# EAGLE design IRIS (EAGLE 6.2)
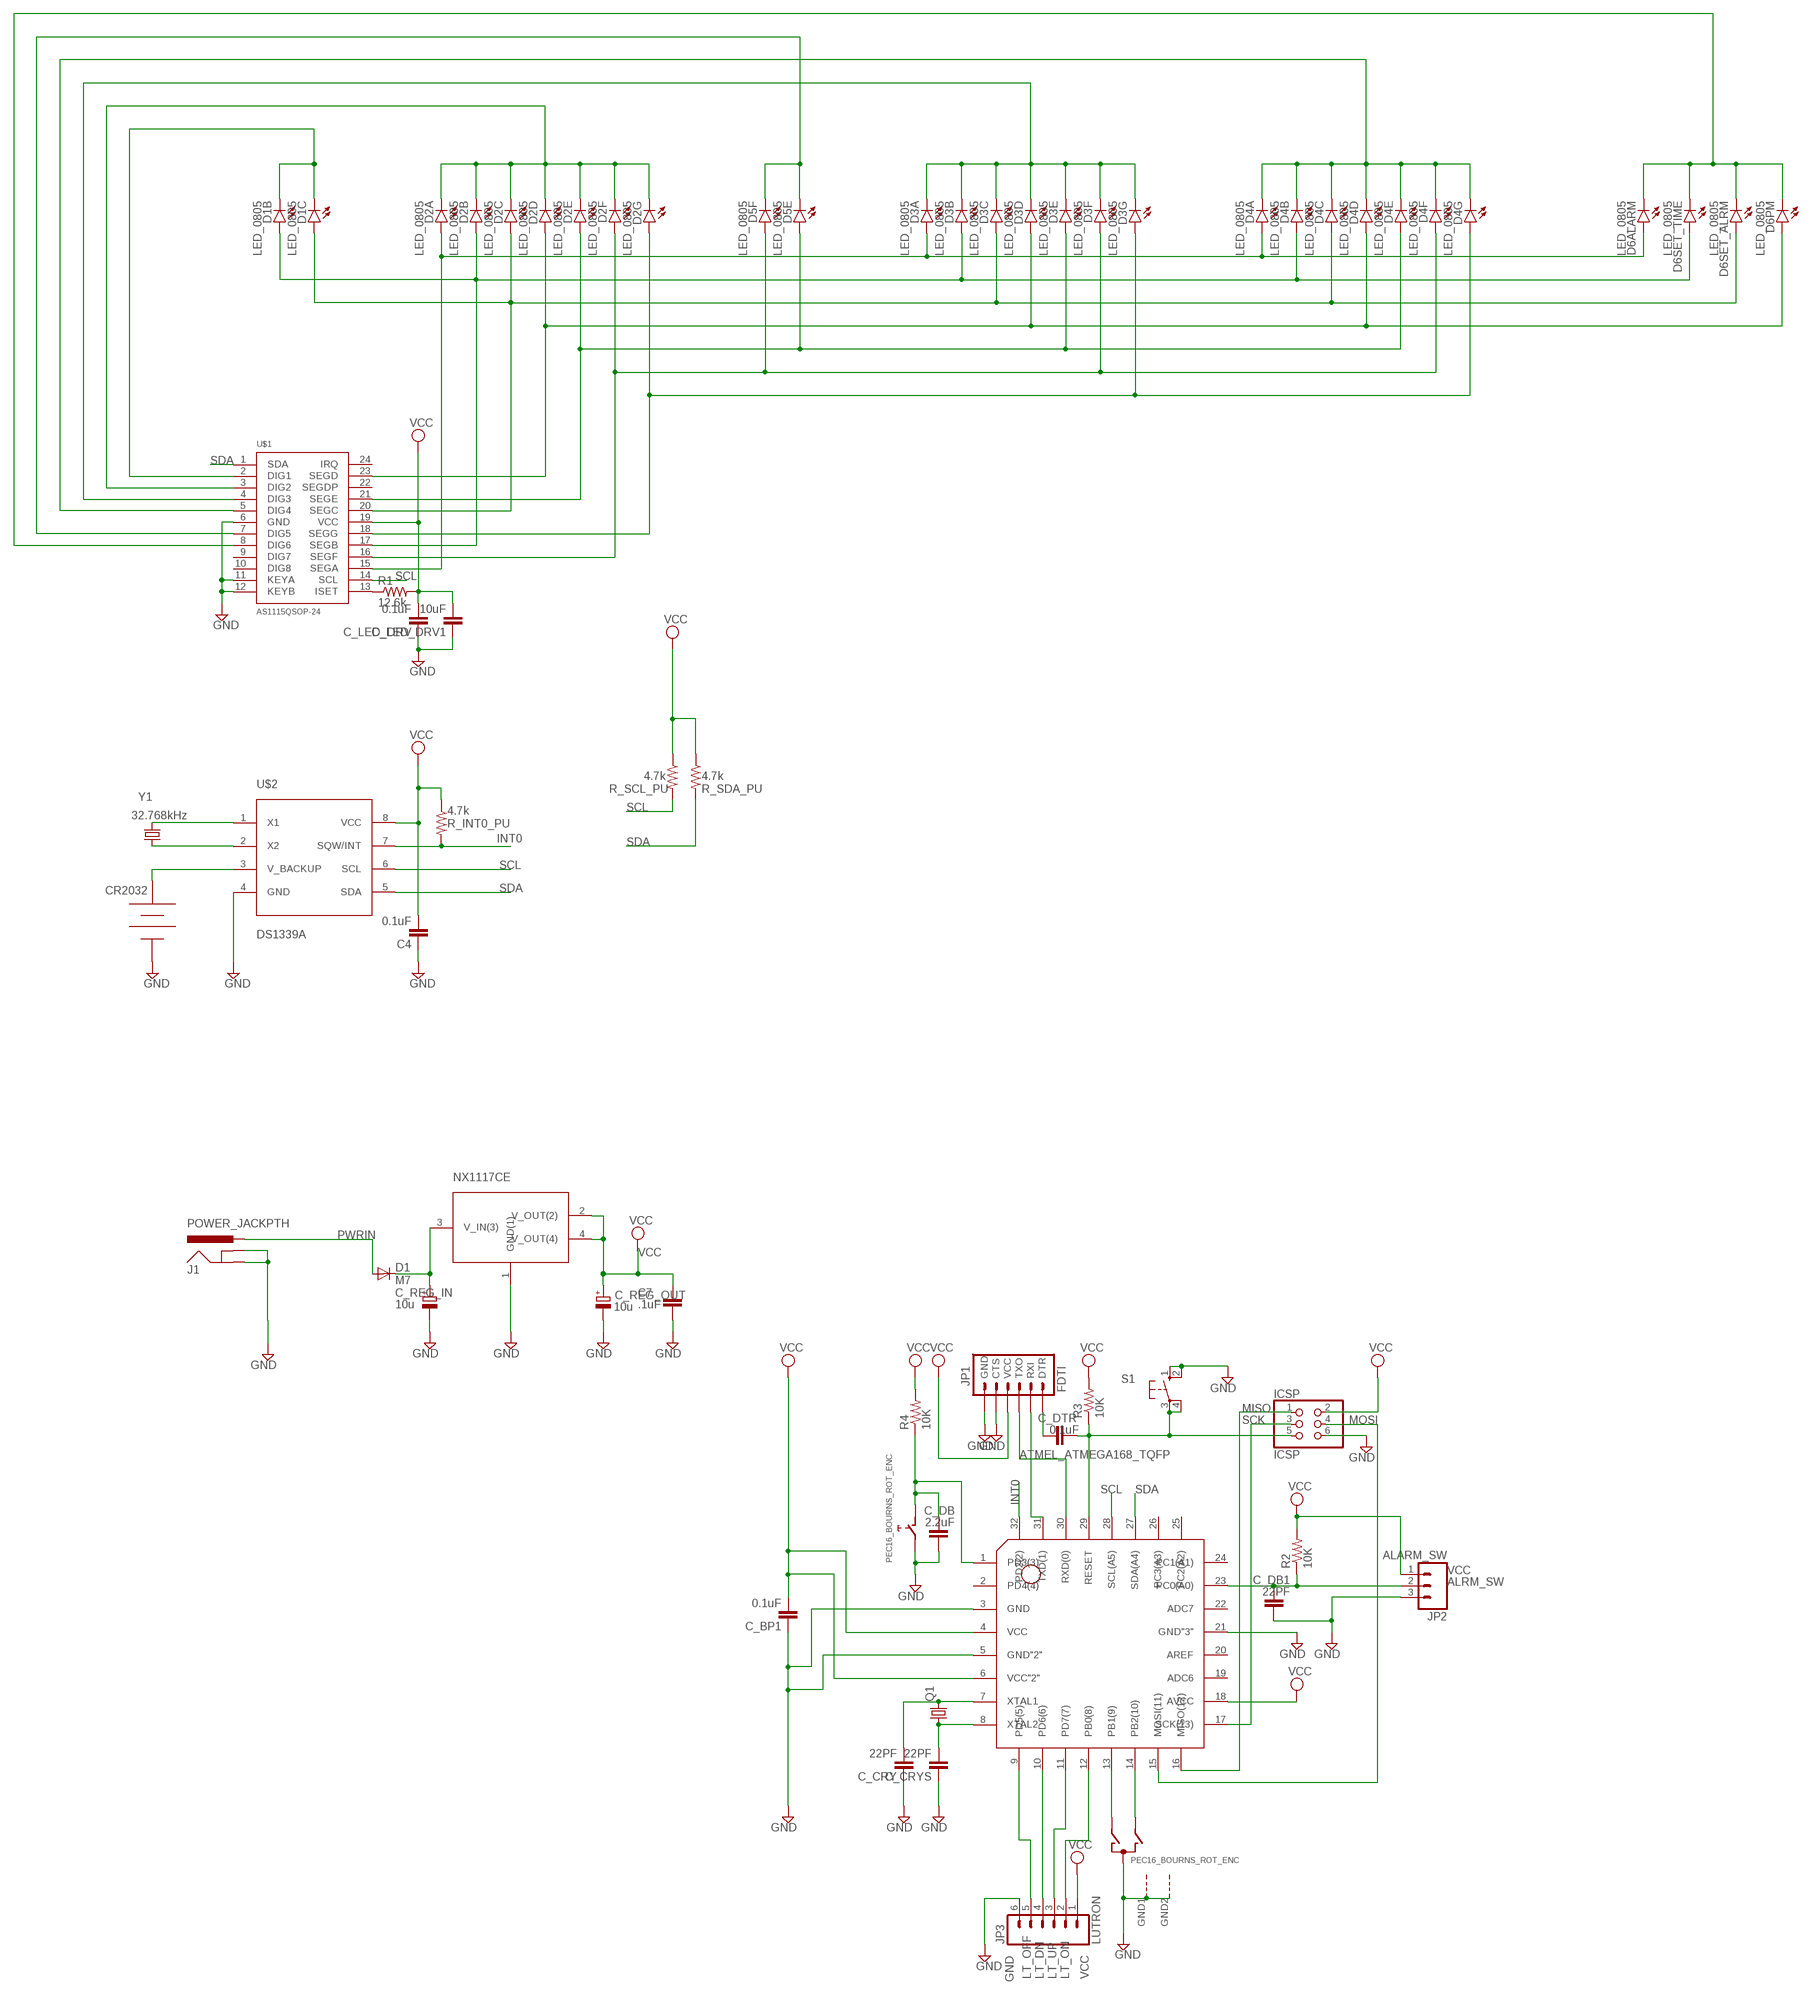
[diagram p0: schematic, sheet 1]

## Parts
C4  0.1uF  CAP0805  [0805]
C7  .1uF  C-EU0603-RND  [C0603-ROUND]
C_BP1  0.1uF  CAP0805  [0805]
C_CRY  22PF  CAP0805  [0805]
C_CRYS  22PF  CAP0805  [0805]
C_DB  2.2uF  CAP0805  [0805]
C_DB1  22PF  CAP0805  [0805]
C_DTR  0.1uF  CAP0805  [0805]
C_LED_DRV  0.1uF  CAP0805  [0805]
C_LED_DRV1  10uF  CAP0805  [0805]
C_REG_IN  10u  CPOL-EUD  [PANASONIC_D]
C_REG_OUT  10u  CPOL-EUD  [PANASONIC_D]
D1  M7  DIODE-SMB  [SMB]
D1B  LED_0805  [LED_0805]
D1C  LED_0805  [LED_0805]
D2A  LED_0805  [LED_0805]
D2B  LED_0805  [LED_0805]
D2C  LED_0805  [LED_0805]
D2D  LED_0805  [LED_0805]
D2E  LED_0805  [LED_0805]
D2F  LED_0805  [LED_0805]
D2G  LED_0805  [LED_0805]
D3A  LED_0805  [LED_0805]
D3B  LED_0805  [LED_0805]
D3C  LED_0805  [LED_0805]
D3D  LED_0805  [LED_0805]
D3E  LED_0805  [LED_0805]
D3F  LED_0805  [LED_0805]
D3G  LED_0805  [LED_0805]
D4A  LED_0805  [LED_0805]
D4B  LED_0805  [LED_0805]
D4C  LED_0805  [LED_0805]
D4D  LED_0805  [LED_0805]
D4E  LED_0805  [LED_0805]
D4F  LED_0805  [LED_0805]
D4G  LED_0805  [LED_0805]
D5E  LED_0805  [LED_0805]
D5F  LED_0805  [LED_0805]
D6ALARM  LED_0805  [LED_0805]
D6PM  LED_0805  [LED_0805]
D6SET_ALRM  LED_0805  [LED_0805]
D6SET_TIME  LED_0805  [LED_0805]
ICSP  ICSP  PINHD-2X3  [2X03]
J1  POWER_JACKPTH  [POWER_JACK_PTH]
JP1  FDTI  ARDUINO_SERIAL_PROGRAMLONGPADS  [1X06_LONGPADS]
JP2  ALARM_SW  M03LONGPADS  [1X03_LONGPADS]
JP3  LUTRON  M06LONGPADS  [1X06_LONGPADS]
Q1  CRYSTALHC49S  [HC49/S]
R1  12.6k  R-US_R0805  [R0805]
R2  10K  R-US_R0805  [R0805]
R3  10K  R-US_R0805  [R0805]
R4  10K  R-US_R0805  [R0805]
R_INT0_PU  4.7k  R-US_R0805  [R0805]
R_SCL_PU  4.7k  R-US_R0805  [R0805]
R_SDA_PU  4.7k  R-US_R0805  [R0805]
S1  10-XX  [B3F-10XX]
U$1  AS1115QSOP-24  [SSOP24]
U$2  DS1339A  [8_USOP]
U$3  CR2032  [CR2032]
U$4  PEC16_BOURNS_ROT_ENC  [ENCODER_ROTARY]
U$5  ATMEL_ATMEGA168_TQFP  [TQFP_32_ATMEGA168]
U$6  NX1117CE  [LINEAR_REG_SOT223]
Y1  32.768kHz  CRYSTAL32-SMD  [CRYSTAL-32KHZ-SMD]

## Nets
ALRM_SW: C_DB1.2 JP2.2 R2.1 U$5.23(PC0(A0))
D6TIME: D6ALARM.C D6PM.C D6SET_ALRM.C D6SET_TIME.C U$1.8(DIG6)
DIGIT1: D1B.C D1C.C U$1.2(DIG1)
DIGIT2: D2A.C D2B.C D2C.C D2D.C D2E.C D2F.C D2G.C U$1.3(DIG2)
DIGIT3: D3A.C D3B.C D3C.C D3D.C D3E.C D3F.C D3G.C U$1.4(DIG3)
DIGIT4: D4A.C D4B.C D4C.C D4D.C D4E.C D4F.C D4G.C U$1.5(DIG4)
DIGIT5: D5E.C D5F.C U$1.7(DIG5)
GND: C4.1 C7.1 C_BP1.1 C_CRY.1 C_CRYS.1 C_DB1.1 C_DB.1 C_LED_DRV1.1 C_LED_DRV.1 C_REG_IN.- C_REG_OUT.- ICSP.6 J1.GND J1.GNDBREAK JP1.5(CTS) JP1.6(GND) JP2.3 JP3.6 S1.1(S) S1.2(S1) U$1.6(GND) U$1.11(KEYA) U$1.12(KEYB) U$2.4(GND) U$3.GND U$4.C U$4.E U$4.GND1(G) U$4.GND2(G) U$5.3(GND) U$5.5(GND"2") U$5.21(GND"3") U$6.1(GND(1))
INT0: R_INT0_PU.2 U$2.7(SQW/INT) U$5.32(PD2(2))
LT_DN: JP3.4 U$5.10(PD6(6))
LT_OFF: JP3.5 U$5.9(PD5(5))
LT_ON: JP3.2 U$5.12(PB0(8))
LT_UP: JP3.3 U$5.11(PD7(7))
MISO: ICSP.1 U$5.16(MISO(12))
MOSI: ICSP.4 U$5.15(MOSI(11))
N$1: D1B.A D2B.A D3B.A D4B.A D6SET_TIME.A U$1.17(SEGB)
N$2: D1C.A D2C.A D3C.A D4C.A D6SET_ALRM.A U$1.20(SEGC)
N$4: U$2.2(X2) Y1.X1
N$5: U$2.1(X1) Y1.X2
N$6: D2A.A D3A.A D4A.A D6ALARM.A U$1.15(SEGA)
N$7: C_DB.2 R4.1 U$4.D U$5.1(PD3(3))
N$9: D2D.A D3D.A D4D.A D6PM.A U$1.23(SEGD)
N$10: D2E.A D3E.A D4E.A D5E.A U$1.21(SEGE)
N$11: D2F.A D3F.A D4F.A D5F.A U$1.16(SEGF)
N$12: D2G.A D3G.A D4G.A U$1.18(SEGG)
N$13: JP1.2(RXI) U$5.31(TXD(1))
N$14: R1.1 U$1.13(ISET)
N$15: JP1.3(TXO) U$5.30(RXD(0))
N$16: C_DTR.2 JP1.1(DTR)
N$18: U$4.A U$5.13(PB1(9))
N$19: U$4.B U$5.14(PB2(10))
N$34: C_CRY.2 Q1.2 U$5.7(XTAL1)
N$35: C_CRYS.2 Q1.1 U$5.8(XTAL2)
PWRIN [power]: D1.A J1.PWR
RESET: C_DTR.1 ICSP.5 R3.1 S1.3(P) S1.4(P1) U$5.29(RESET)
SCK: ICSP.3 U$5.17(SCK(13))
SCL: R_SCL_PU.2 U$1.14(SCL) U$2.6(SCL) U$5.28(SCL(A5))
SDA: R_SDA_PU.2 U$1.1(SDA) U$2.5(SDA) U$5.27(SDA(A4))
V+: U$2.3(V_BACKUP) U$3.V+
V_IN(3): C_REG_IN.+ D1.C U$6.3(V_IN(3))
VCC: C4.2 C7.2 C_BP1.2 C_LED_DRV1.2 C_LED_DRV.2 C_REG_OUT.+ ICSP.2 JP1.4(VCC) JP2.1 JP3.1 R1.2 R2.2 R3.2 R4.2 R_INT0_PU.1 R_SCL_PU.1 R_SDA_PU.1 U$1.19(VCC) U$2.8(VCC) U$5.4(VCC) U$5.6(VCC"2") U$5.18(AVCC) U$6.2(V_OUT(2)) U$6.4(V_OUT(4))
Unconnected: U$1.9(DIG7) U$1.10(DIG8) U$1.22(SEGDP) U$1.24(IRQ) U$5.2(PD4(4)) U$5.19(ADC6) U$5.20(AREF) U$5.22(ADC7) U$5.24(PC1(A1)) U$5.25(PC2(A2)) U$5.26(PC3(A3))

## Library data of the parts
C4 C_BP1 C_CRY C_CRYS C_DB C_DB1 C_DTR C_LED_DRV C_LED_DRV1 = SparkFun:CAP: Capacitor Standard 0603 ceramic capacitor, and 0.1" leaded capacitor.
C7 = SmartPrj:C-EU: CAPACITOR, European symbol
C_REG_IN C_REG_OUT = rcl:CPOL-EU: POLARIZED CAPACITOR, European symbol
D1 = diode:DIODE-: DIODE
D1B D1C D2A D2B D2C D2D D2E D2F D2G D3A D3B D3C D3D D3E D3F D3G D4A D4B D4C D4D D4E D4F D4G D5E D5F D6ALARM D6PM D6SET_ALRM D6SET_TIME = Eady:LED_0805
ICSP = pinhead:PINHD-2X3: PIN HEADER
J1 = SparkFun-Connectors:POWER_JACK: Power Jack This is the standard 5.5mm barrel jack for power. The PTH is the most common, proven, reliable, footprint. All others are experimental. The Slot footprint only works if the mill layer is transmitted to the PCB fab house so be warned. Spark Fun Electronics SKU : PRT-00119. Mating wall wart : TOL-00298 (and others)
JP1 = SparkFun-Connectors:ARDUINO_SERIAL_PROGRAM: FTDI connector footprints
JP2 = SparkFun-Connectors:M03: Header 3 Standard 3-pin 0.1" header. Use with straight break away headers (SKU : PRT-00116), right angle break away headers (PRT-00553), swiss pins (PRT-00743), machine pins (PRT-00117), and female headers (PRT-00115). Molex polarized connector foot print use with SKU : PRT-08232 with associated crimp pins and housings.
JP3 = SparkFun-Connectors:M06: Header 6 Standard 6-pin 0.1" header. Use with straight break away headers (SKU : PRT-00116), right angle break away headers (PRT-00553), swiss pins (PRT-00743), machine pins (PRT-00117), and female headers (PRT-00115). Molex polarized connector foot print use with SKU : PRT-08094 with associated crimp pins and housings. NOTES ON THE VARIANTS LOCK and LOCK_LONGPADS... This footprint was designed to help hold the alignment of a through-hole component (i.e. 6-pin header) while soldering it into place. You may notice that each hole has been shifted either up or down by 0.005 of an inch from it's more standard position (which is a perfectly straight line). This slight alteration caused the pins (the squares in the middle) to touch the edges of the holes. Because they are alternating, it causes a "brace" to hold the component in place. 0.005 has proven to be the perfect amount of "off-center" position when using our standard breakaway headers. Although looks a little odd when you look at the bare footprint, once you have a header in there, the alteration is very hard to notice. Also, if you push a header all the way into place, it is covered up entirely on the bottom side. This idea of altering the position of holes to aid alignment will be further integrated into the Sparkfun Library for other footprints. It can help hold any component with 3 or more connection pins.
Q1 = crystal:CRYSTAL: CRYSTAL; OC_FARNELL: 1667008; OC_NEWARK: unknown
R1-R4 R_INT0_PU R_SCL_PU R_SDA_PU = resistor:R-US_: RESISTOR, American symbol
S1 = switch-omron:10-XX: OMRON SWITCH; MPN: B3F-1000; OC_FARNELL: 176432; OC_NEWARK: 36M3542
U$1 = Eady2:AS1115
U$2 = Eady:DS1339A
U$3 = Eady:CR2032
U$4 = Eady:PEC16_BOURNS_ROT_ENC
U$5 = Eady:ATMEL_ATMEGA168_TQFP
U$6 = Eady:NX1117CE
Y1 = SparkFun-FreqCtrl:CRYSTAL: Various standard crystals. Proven footprints. Spark Fun Electronics SKU : COM-00534

## Net classes
0 default: width 0.254 mm, clearance 0.254 mm
1 power: width 0.61 mm, drill 0.711 mm, clearance 0.33 mm
2 gnd: width 0.305 mm, drill 0.711 mm, clearance 0.254 mm
3 usbvcc: width 0.508 mm, drill 0.711 mm, clearance 0.254 mm
4 aref: width 0.406 mm

## Board
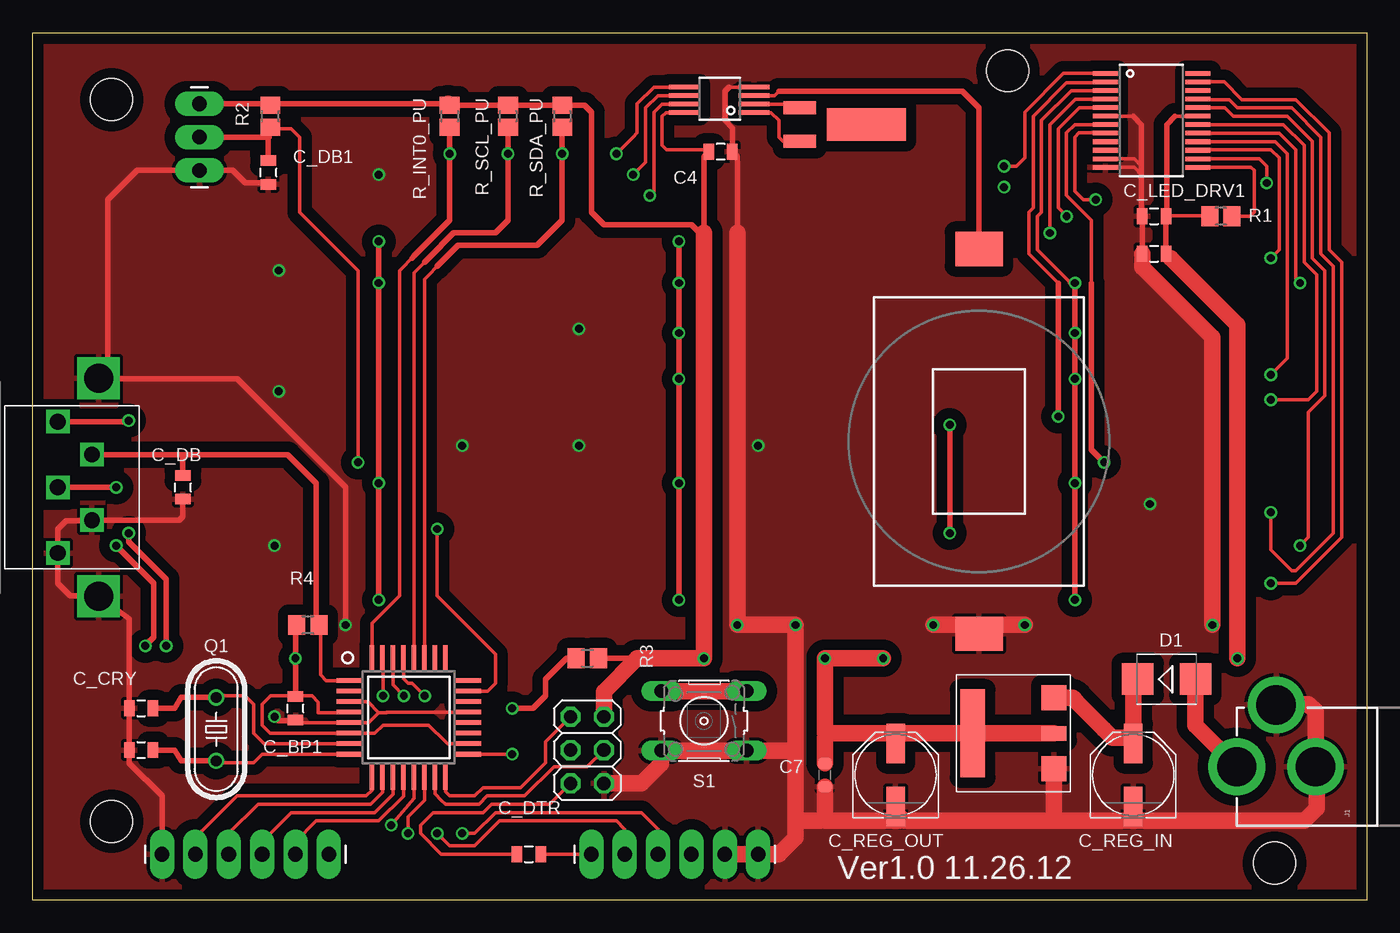
[diagram p1: board, top side]
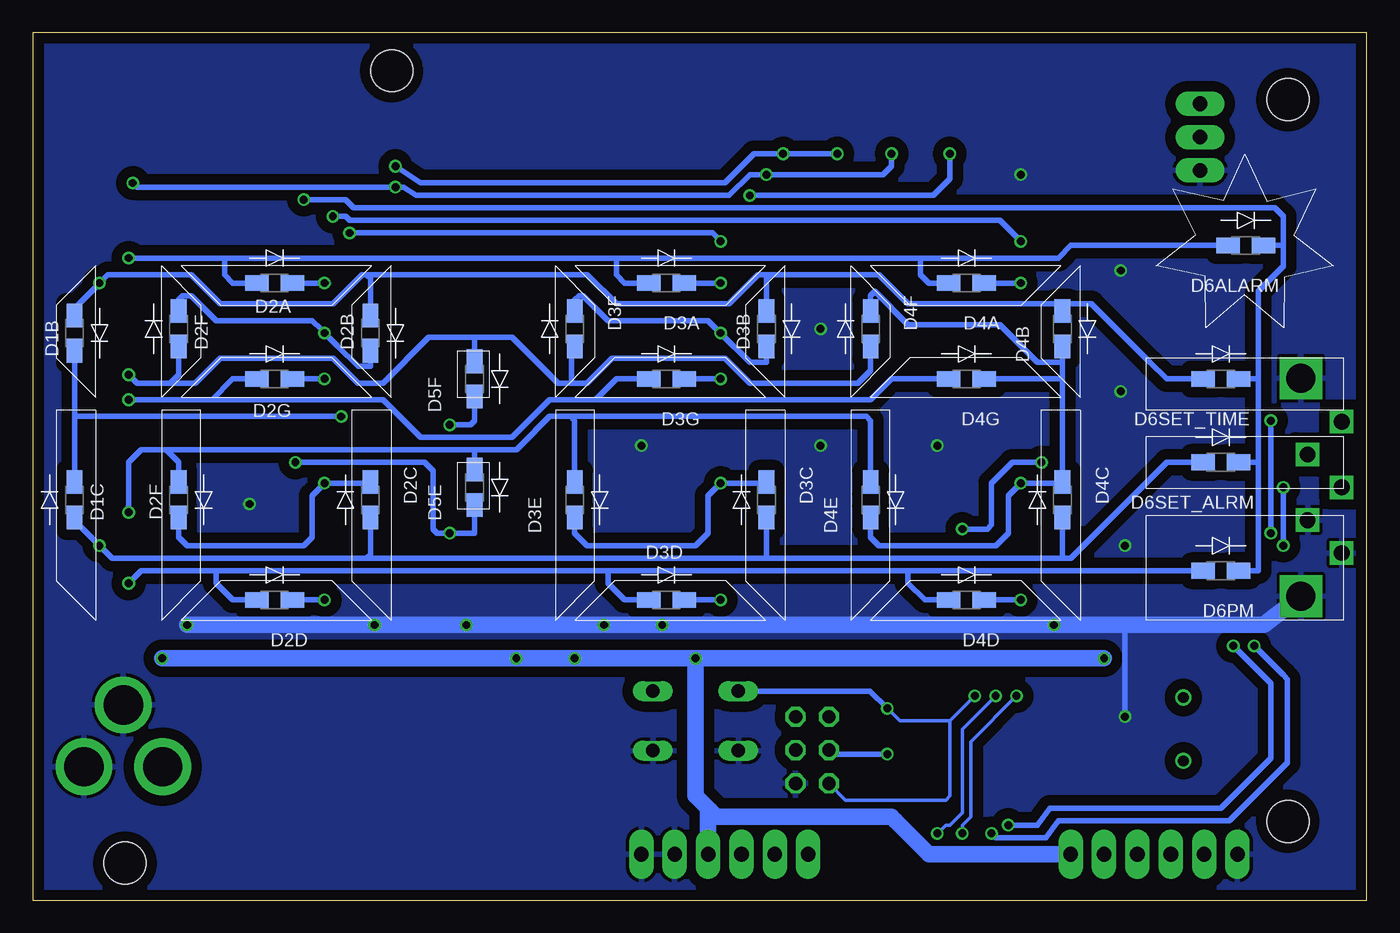
[diagram p2: board, bottom side, seen from below]

Size 101.6 x 66.04 mm. Coordinates in mm from the lower left corner, seen from the top.
Outline: 0,0 0,66.04 101.6,66.04 101.6,0 0,0
Copper layers (1*16): Top 0.0356mm / dielectric 1.5011mm / Bottom 0.0356mm
Design rules: minimum track width 6mil, minimum drill 13mil, track to track 6mil, track to pad 6mil, pad to pad 6mil, via to via 6mil, smd to smd 6mil, copper to edge 15mil, drill to drill 6mil, minimum pad ring 7mil, minimum via ring 7mil, stop-mask expansion 4mil, vias tented up to drill 0mil, thermal gap 10mil
Holes 3.2 mm at 6,6 6,60.95 74.26,63.15 94.58,2.83

### Footprints (pad centres in the part's own frame; a part is rotated, then mirrored left to right if it is on the bottom)
0805 = smd 0.8 x 1.2: 1 -0.9,0; 2 0.9,0
C0603-ROUND = smd 0.898 x 1.1: 1 -0.889,0; 2 0.889,0
PANASONIC_D = smd 3 x 1.4: + 2.4,0; - -2.4,0
SMB = smd 2.4 x 2.4: A 2.2,0; C -2.2,0
LED_0805 = smd 1.8 x 1.2: A -1.35,0; C 1.35,0
2X03 = drill 1.016 octagon: 1 -2.54,-1.27; 2 -2.54,1.27; 3 0,-1.27; 4 0,1.27; 5 2.54,-1.27; 6 2.54,1.27
POWER_JACK_PTH = drill 2.997 pad 4.318: GND 0,7.7; GNDBREAK 4.7,10.7; PWR 0,13.7
1X06_LONGPADS = drill 1.118 pad 1.88 long: 1 0,0; 2 2.54,0; 3 5.08,0; 4 7.62,0; 5 10.16,0; 6 12.7,0
1X03_LONGPADS = drill 1.118 pad 1.88 long: 1 0,0; 2 2.54,0; 3 5.08,0
HC49/S = drill 0.813: 1 -2.413,0; 2 2.413,0
R0805 = smd 1.3 x 1.5: 1 -0.85,0; 2 0.85,0
B3F-10XX = drill 1.016 long: 1 -3.251,2.261; 2 3.251,2.261; 3 -3.251,-2.261; 4 3.251,-2.261
SSOP24 = smd 0.348 x 1.905: 1 -3.575,-3.402; 2 -2.925,-3.402; 3 -2.275,-3.402; 4 -1.625,-3.402; 5 -0.975,-3.402; 6 -0.325,-3.402; 7 0.325,-3.402; 8 0.975,-3.402; 9 1.625,-3.402; 10 2.275,-3.402; 11 2.925,-3.402; 12 3.575,-3.402; 13 3.575,3.656; 14 2.925,3.656; 15 2.275,3.656; 16 1.625,3.656; 17 0.975,3.656; 18 0.325,3.656; 19 -0.325,3.656; 20 -0.975,3.656; 21 -1.625,3.656; 22 -2.275,3.656; 23 -2.925,3.656; 24 -3.575,3.656
8_USOP = smd 2.35 x 0.35: 1 0,1.95; 2 0,1.3; 3 0,0.65; 4 0,0; 5 5.3,0; 6 5.3,0.65; 7 5.3,1.3; 8 5.3,1.95
CR2032 = smd 2.6 x 3.6: GND 14.65,0; V+ -14.65,0
ENCODER_ROTARY = drill 1.2 square: A -5,0; B 0,0; C 5,0; D -2.5,2.6; E 2.5,2.6 | drill 2.2 square: GND1 -8.3,3.1; GND2 8.3,3.1
TQFP_32_ATMEGA168 = smd 2 x 0.35: 1 0,5.6; 2 0,4.8; 3 0,4; 4 0,3.2; 5 0,2.4; 6 0,1.6; 7 0,0.8; 8 0,0; 17 9,0; 18 9,0.8; 19 9,1.6; 20 9,2.4; 21 9,3.2; 22 9,4; 23 9,4.8; 24 9,5.6 | smd 0.35 x 2: 9 1.7,-1.7; 10 2.5,-1.7; 11 3.3,-1.7; 12 4.1,-1.7; 13 4.9,-1.7; 14 5.7,-1.7; 15 6.5,-1.7; 16 7.3,-1.7; 25 7.3,7.3; 26 6.5,7.3; 27 5.7,7.3; 28 4.9,7.3; 29 4.1,7.3; 30 3.3,7.3; 31 2.5,7.3; 32 1.7,7.3
LINEAR_REG_SOT223 = smd 1.9 x 1.9: 1 -2.7,0; 3 2.7,0 | smd 1.1 x 1.9: 2 0,0 | smd 6.7 x 1.9: 4 0,6.2
CRYSTAL-32KHZ-SMD = smd 2.5 x 6: SHEILD 0,5.08 | smd 1 x 2.5: X1 -1.27,0; X2 1.27,0

### Placement (x,y rotation side)
C4  52.39,56.99 180 top
C7  60.33,9.53 90 top
C_BP1  20,14.61 90 top
C_CRY  8.26,14.61 0 top
C_CRYS  8.26,11.43 0 top
C_DB  11.43,31.43 90 top
C_DB1  17.94,55.4 90 top
C_DTR  37.78,3.49 0 top
C_LED_DRV  85.41,52.07 0 top
C_LED_DRV1  85.41,49.21 0 top
C_REG_IN  83.82,9.53 90 top
C_REG_OUT  65.72,9.53 90 top
D1  86.36,16.83 0 top
D1B  98.42,43.18 270 bottom
D1C  98.42,30.48 90 bottom
D2A  83.19,46.99 0 bottom
D2B  75.88,43.18 270 bottom
D2C  75.88,30.48 90 bottom
D2D  83.19,22.86 0 bottom
D2E  90.49,30.48 270 bottom
D2F  90.49,43.5 90 bottom
D2G  83.19,39.69 0 bottom
D3A  53.34,46.99 0 bottom
D3B  45.72,43.5 270 bottom
D3C  45.72,30.48 90 bottom
D3D  53.34,22.86 0 bottom
D3E  60.33,30.48 270 bottom
D3F  60.33,43.5 90 bottom
D3G  53.34,39.69 0 bottom
D4A  30.48,46.99 0 bottom
D4B  23.18,43.5 270 bottom
D4C  23.18,30.48 90 bottom
D4D  30.48,22.86 0 bottom
D4E  37.78,30.48 270 bottom
D4F  37.78,43.5 90 bottom
D4G  30.48,39.69 0 bottom
D5E  67.94,31.43 270 bottom
D5F  67.94,39.69 270 bottom
D6ALARM  9.21,49.85 0 bottom
D6PM  11.11,25.08 0 bottom
D6SET_ALRM  11.11,33.34 0 bottom
D6SET_TIME  11.11,39.69 0 bottom
ICSP  42.23,11.43 270 top
J1  105.41,10.16 90 top
JP1  42.55,3.49 0 top
JP2  12.7,60.64 270 top
JP3  22.54,3.49 180 top
Q1  13.97,13.02 90 top
R1  90.49,52.07 180 top
R2  18.1,59.69 90 top
R3  42.23,18.41 0 top
R4  20.95,20.95 180 top
R_INT0_PU  31.75,59.69 270 top
R_SCL_PU  36.2,59.69 270 top
R_SDA_PU  40.32,59.69 270 top
S1  51.12,13.65 180 top
U$1  85.09,59.37 270 top
U$2  54.93,61.91 180 top
U$3  72.07,34.92 270 top
U$4  1.91,31.43 270 top
U$5  24.13,11.11 0 top
U$6  77.79,12.7 90 top
Y1  58.42,59.05 270 top

### Tracks (layer width: path | path; a pad name or v marks a point on that pad's centre or on a via)
ALRM_SW  (via drill 0.6)
  Top 0.254: U$5.23 34.65,15.91 35.24,16.51 35.24,18.73 30.8,23.18 v30.8,28.26 | v24.77,33.34 24.77,47.94 20.32,52.39 20.32,58.1 19.68,58.74 18.2,58.74 R2.1
  Top 0.406: JP2.2 18,58.1 R2.1 17.94,58.68 C_DB1.2
  Bottom 0.406: v30.8,28.26 28.89,28.26 28.57,28.57 28.57,31.75 26.99,33.34 v24.77,33.34
D6TIME  (via drill 0.6)
  Top 0.254: v80.96,53.34 80.01,53.34 79.38,53.98 79.38,58.1 79.69,58.42 81.67,58.42 U$1.8
  Bottom 0.406: D6PM.C 8.26,25.08 8.26,33.34 | 8.26,33.34 8.26,39.69 | 8.26,39.69 8.26,46.35 6.35,48.26 6.35,49.85 | 6.35,49.85 D6ALARM.C 6.35,49.85 | D6SET_TIME.C 8.26,39.69 | D6SET_ALRM.C 8.26,33.34 | 6.35,49.85 6.35,52.07 6.51,52.23 6.99,52.7 77.15,52.7 77.79,53.34 v80.96,53.34
DIGIT1  (via drill 0.6)
  Top 0.254: U$1.2 81.62,62.23 78.74,62.23 76.2,59.69 76.2,54.29 76.2,52.7 75.88,52.39 75.88,49.21 78.11,46.99
  Top 0.406: v78.11,36.83 78.11,45.4 78.11,46.99
  Bottom 0.406: D1C.C 98.42,36.83 | 98.42,36.83 D1B.C 98.42,41.27 | v78.11,36.83 93.98,36.83 98.42,36.83
DIGIT2  (via drill 0.6)
  Top 0.254: U$1.3 79.11,61.65 76.83,59.37 76.83,53.98 76.83,52.39 76.52,52.07 76.52,49.53 79.06,46.99
  Top 0.406: v79.38,22.86 v79.38,31.75 v79.38,39.69 v79.38,43.18 v79.38,46.99 79.06,46.99
  Bottom 0.406: D2D.C 81.6,22.86 80.01,22.86 v79.38,22.86 | D2C.C 75.88,31.75 v79.38,31.75 80.33,30.8 80.33,27.62 80.96,26.99 89.85,26.99 90.49,27.62 D2E.C | v79.38,39.69 79.69,39.69 81.6,39.69 D2G.C | D2B.C 75.88,41.91 75.88,42.23 75.88,40.64 76.83,40.64 78.42,42.23 v79.38,43.18 | v79.38,46.99 79.06,46.99 81.6,46.99 D2A.C | 79.69,43.5 80.33,44.13 87.63,44.13 89.53,46.04 89.85,46.04 90.17,46.04 90.49,45.72 D2F.C 90.49,44.77 | 79.69,43.5 v79.38,43.18 | v79.38,43.18 79.69,43.5
DIGIT3  (via drill 0.6)
  Top 0.254: U$1.4 79.41,61 77.47,59.05 77.47,53.66 77.47,51.75 v77.47,50.8
  Top 0.406: v49.21,22.86 v49.21,31.75 v49.21,39.69 v49.21,43.18 v49.21,46.99 v49.21,50.16
  Bottom 0.406: v49.21,22.86 51.75,22.86 D3D.C | D3C.C 45.72,31.75 48.58,31.75 v49.21,31.75 50.16,30.8 50.16,27.94 51.12,26.99 59.37,26.99 60.33,27.94 D3E.C | 49.53,39.69 v49.21,39.69 49.53,39.69 | 49.53,39.69 51.75,39.69 D3G.C | D3B.C 45.72,41.91 45.72,40.96 46.99,40.96 v49.21,43.18 50.16,44.13 57.78,44.13 59.69,46.04 60.01,46.04 60.33,45.72 D3F.C | v49.21,46.99 51.75,46.99 D3A.C | v49.21,50.16 49.85,50.8 68.58,50.8 | 68.58,50.8 68.9,50.8 | v77.47,50.8 68.58,50.8
DIGIT4  (via drill 0.6)
  Top 0.254: U$1.5 79.72,60.35 78.11,58.74 78.11,52.7 v78.74,52.07
  Top 0.406: v26.35,22.86 v26.35,31.75 v26.35,46.99 v26.35,50.16
  Bottom 0.406: v26.35,31.75 26.04,31.75 | v26.35,22.86 28.89,22.86 D4D.C | 26.04,31.75 23.18,31.75 D4C.C 23.18,39.69 | 26.04,31.75 v26.35,31.75 | v26.35,46.99 28.89,46.99 D4A.C | D4B.C 23.18,40.96 | 23.18,40.96 23.18,39.69 | D4E.C 37.78,27.62 37.15,26.99 28.26,26.99 27.3,27.94 27.3,30.8 v26.35,31.75 | D4F.C 37.78,46.04 37.47,46.35 34.92,43.81 27.94,43.81 25.08,40.96 23.18,40.96 | D4G.C 23.18,39.69 | v78.74,52.07 77.79,52.07 77.47,51.75 27.94,51.75 v26.35,50.16
DIGIT5  (via drill 0.6)
  Top 0.254: U$1.7 80,59.05 79.37,59.05 78.74,58.42 78.74,53.66 79.69,52.7 80.64,51.75 80.64,46.99
  Top 0.406: v69.85,36.2 69.85,35.56 v69.85,27.94 | 80.64,46.99 80.64,34.29 v81.6,33.34
  Bottom 0.406: D5E.C 67.94,27.94 v69.85,27.94 70.8,27.94 71.12,28.26 71.12,32.7 71.75,33.34 80.33,33.34 v81.6,33.34 | v69.85,36.2 68.26,36.2 67.94,36.51 67.94,38.1 D5F.C
GND  (via drill 0.6)
  Top 0.254: U$1.12 83.74,55.8 83.9,55.8 84.45,55.24 | 84.45,52.12 C_LED_DRV.1 | U$1.11 83.89,56.45 84.45,55.88 | U$1.6 83.81,59.7 | 53.02,61.91 U$2.4 | U$5.21 26.96,14.31 26.94,14.29 26.35,14.29 | 19.95,13.65 C_BP1.1 20.2,13.51 21.77,13.51 U$5.5 25.58,13.51 26.35,14.29 | U$5.3 25.53,15.11 26.35,14.29
  Top 0.406: 84.45,52.12 84.45,55.24 84.45,55.88 84.45,59.05 83.81,59.7 | C_LED_DRV.1 C_LED_DRV1.1 | 53.66,50.8 53.66,56.62 C4.1 53.29,58.79 52.7,59.37 52.7,61.59 53.02,61.91 | v75.56,20.95 72.75,20.95 U$3.GND | C_DB1.1 17.83,54.61 16.19,54.61 15.24,55.56 JP2.3 7.94,55.56 5.71,53.34 5.71,39.81 U$4.GND1 5.68,39.69 15.56,39.69 23.81,31.43 v23.81,20.95 | JP3.6 9.84,7.94 7.36,10.43 C_CRYS.1 C_CRY.1 7.36,21.42 U$4.GND2 4.96,23.18 2.86,23.18 1.91,24.13 U$4.C 1.91,28.26 2.54,28.89 4.46,28.89 U$4.E 10.15,28.93 11.15,28.93 11.43,29.21 C_DB.1 | v18.41,13.97 18.73,13.65 19.95,13.65
  Top 1.27: C_LED_DRV1.1 84.51,48.21 89.85,42.86 v89.85,20.95 | 53.66,50.8 53.66,41.59 v53.66,20.95 v58.1,20.95 58.1,11.75 | v68.58,20.95 v75.56,20.95 | 66.36,6.03 66.2,6.19 | 66.2,6.19 65.88,6.51 | 65.88,6.51 65.72,6.67 C_REG_OUT.- | 60.33,6.35 60.33,6.03 66.04,6.03 66.2,6.19 | C7.1 60.33,6.35 | 60.33,6.35 60.01,6.03 58.1,6.03 | 58.1,6.03 58.1,11.75 | 77.79,6.03 77.47,6.03 66.36,6.03 | 66.36,6.03 65.88,6.51 | 77.79,6.03 83.82,6.03 | 83.82,6.03 C_REG_IN.- | 83.82,6.03 94.93,6.03 96.84,6.03 97.79,6.99 97.79,10.08 J1.GND 97.71,14.37 97.16,14.92 94.77,14.92 J1.GNDBREAK | U$6.1 77.79,6.03 | JP1.5 JP1.6 56.83,3.49 58.1,4.76 58.1,6.03 | 58.1,11.75 57.75,11.39 S1.1 S1.2 47.87,10.4 46.35,8.89 ICSP.6
  Bottom 0.254: 21.27,20.95 19.68,20.95 | 18.41,14.29 v18.41,13.97
  Bottom 0.406: 18.41,14.29 18.41,20.64 18.1,20.95
  Bottom 1.27: v89.85,20.95 v75.56,20.95 v68.58,20.95 v58.1,20.95 v53.66,20.95 v23.81,20.95 21.27,20.95 18.41,20.95 18.1,20.95 9.09,20.95 7.82,20.95 U$4.GND2
  other vias: 18.73,47.94 26.35,55.24 18.73,38.73 18.41,26.99 32.7,34.61 41.59,34.61 55.24,34.61 41.59,43.5 85.09,30.16
  pour Bottom (isolate 0.8): 0.95,65.09 100.65,65.09 100.65,0.95 0.95,0.95
  pour Top (isolate 0.8): 0.95,65.09 100.65,65.09 100.65,0.95 0.95,0.95
INT0  (via drill 0.6)
  Top 0.254: U$2.7 47.91,60.61 47.31,60.01 47.31,54.61 47.31,53.98 v46.99,53.66 | U$5.32 25.83,20.84 25.83,21.07 27.94,23.18 27.94,47.94 29.05,49.05
  Top 0.406: R_INT0_PU.2 v31.75,56.83 31.75,51.75 29.05,49.05 28.89,48.9
  Bottom 0.406: v46.99,53.66 33.02,53.66 31.75,54.93 v31.75,56.83
LT_DN
  Top 0.254: U$5.10 26.63,8.21 25.72,7.3 17.14,7.3 14.92,5.08 JP3.4
LT_OFF
  Top 0.254: U$5.9 25.83,8.37 25.4,7.94 15.56,7.94 14.61,6.99 13.65,6.03 12.38,4.76 JP3.5
LT_ON
  Top 0.254: U$5.12 28.23,7.91 26.35,6.03 21.59,6.03 20,4.45 JP3.2
LT_UP
  Top 0.254: U$5.11 27.43,8.06 26.04,6.67 19.68,6.67 17.46,4.45 JP3.3
MISO
  Top 0.254: U$5.16 31.43,8.26 31.75,7.94 33.66,7.94 34.29,8.57 36.51,8.57 37.15,8.57 39.05,10.48 39.05,12.06 ICSP.1
MOSI
  Top 0.254: U$5.15 30.63,8.11 31.11,7.62 31.43,7.3 33.97,7.3 34.61,7.94 36.51,7.94 37.47,7.94 39.69,10.16 42.23,10.16 ICSP.4
N$1  (via drill 0.6)
  Top 0.254: U$1.17 94.95,58.4 96.2,57.15 96.2,47.31 v96.52,46.99
  Bottom 0.406: D1B.A 98.42,45.09 v96.52,46.99 95.89,47.62 89.53,47.62 87.31,45.4 78.74,45.4 76.52,47.62 76.2,47.62 | 76.2,47.62 59.37,47.62 57.15,45.4 48.58,45.4 46.35,47.62 45.4,47.62 | 45.4,47.62 37.15,47.62 34.92,45.4 26.04,45.4 23.5,45.4 | 23.5,45.4 20.95,45.4 16.51,40.96 15.24,39.69 D6SET_TIME.A | D4B.A 23.18,45.09 23.5,45.4 | D3B.A 45.72,47.31 45.4,47.62 | D2B.A 75.88,47.31 76.2,47.62
N$2  (via drill 0.6)
  Top 0.254: U$1.20 90.78,60.35 91.44,59.69 95.57,59.69 97.47,57.78 97.47,48.9 98.42,47.94 98.42,38.42 97.16,37.15 97.16,27.62 v96.52,26.99
  Bottom 0.406: D1C.A 98.42,28.89 v96.52,26.99 95.57,26.04 76.2,26.04 | 76.2,26.04 45.72,26.04 | 45.72,26.04 23.18,26.04 | 23.18,26.04 22.54,26.04 15.24,33.34 D6SET_ALRM.A | D4C.A 23.18,26.04 | D3C.A 45.72,26.04 | D2C.A 75.88,26.35 76.2,26.04
N$4
  Top 0.254: U$2.2 58.13,60.61
  Top 0.406: 58.13,60.61 Y1.X1
N$5
  Top 0.254: U$2.1 56.24,59.96 56.83,59.37 56.83,58.1 57.15,57.78 Y1.X2
N$6  (via drill 0.6)
  Top 0.254: U$1.15 88.8,57.15 93.66,57.15 94.3,57.15 94.93,56.52 94.93,49.53 v94.3,48.9
  Bottom 0.406: D6ALARM.A 22.54,49.85 23.5,48.9 33.97,48.9 | 33.97,48.9 57.15,48.9 | 57.15,48.9 87,48.9 | 87,48.9 v94.3,48.9 | D2A.A 86.36,46.99 87,47.62 87,48.9 | D3A.A 56.52,46.99 57.15,47.62 57.15,48.9 | D4A.A 33.34,46.99 33.97,47.62 33.97,48.9
N$7
  Top 0.254: U$5.1 22.34,16.71 21.91,17.14 21.91,20.85 R4.1
  Top 0.406: U$4.D 11.43,33.93 | 11.43,33.93 12.06,33.93 19.41,33.93 21.59,31.75 21.59,21.17 R4.1 | C_DB.2 11.43,33.93
N$9  (via drill 0.6)
  Top 0.254: v94.3,24.13 96.2,24.13 99.69,27.62 99.69,48.58 98.74,49.53 98.74,58.42 96.2,60.96 92.08,60.96 90.74,62.3 U$1.23
  Bottom 0.406: D6PM.A 34.92,25.08 | 34.92,25.08 57.78,25.08 | 57.78,25.08 87.63,25.08 | D4D.A 33.66,22.86 34.92,24.13 34.92,25.08 | D3D.A 56.52,22.86 57.47,23.81 57.78,24.13 57.78,25.08 | D2D.A 86.36,22.86 87.63,24.13 87.63,25.08 | 87.63,25.08 93.34,25.08 v94.3,24.13
N$10  (via drill 0.6)
  Top 0.254: v94.3,29.53 94.3,26.67 95.89,25.08 96.2,25.08 99.06,27.94 99.06,48.26 98.11,49.21 98.11,58.1 95.89,60.33 91.76,60.33 91.12,60.96 88.78,60.96 U$1.21
  Bottom 0.406: D4E.A 37.78,36.51 38.1,36.83 60.64,36.83 | 60.64,36.83 62.23,36.83 64.45,34.61 64.77,34.29 67.94,34.29 | D3E.A 60.33,36.51 60.64,36.83 | 67.94,34.29 72.39,34.29 90.49,34.29 91.44,34.29 | D5E.A 67.94,34.29 | 91.44,34.29 93.34,34.29 94.3,33.34 v94.3,29.53 | D2E.A 90.49,33.34 91.44,34.29
N$11  (via drill 0.6)
  Top 0.254: U$1.16 94.65,57.75 95.57,56.83 95.57,41.27 v94.3,40.01
  Bottom 0.406: D3F.A 60.56,41.91 60.56,39.45 60.64,39.37 | 67.94,40.96 D5F.A 67.94,42.86 | D2F.A 90.49,40.01 91.12,39.37 | 67.94,42.86 71.44,42.86 74.93,39.37 76.83,39.37 78.74,41.27 87.31,41.27 89.22,39.37 91.12,39.37 | 67.94,42.86 65.09,42.86 61.59,39.37 60.64,39.37 | 60.64,39.37 59.37,39.37 57.47,41.27 48.9,41.27 46.99,39.37 38.73,39.37 37.78,40.32 D4F.A | 91.12,39.37 93.66,39.37 v94.3,40.01
N$12  (via drill 0.6)
  Top 0.254: v94.3,38.1 95.57,38.1 97.16,38.1 97.79,38.73 97.79,46.67 97.79,47.31 97.79,47.62 96.84,48.58 96.84,57.47 95.26,59.05 U$1.18
  Bottom 0.406: D4G.A 36.2,39.69 37.78,38.1 58.74,38.1 | 58.74,38.1 62.23,38.1 65.09,35.24 72.07,35.24 74.93,38.1 87.95,38.1 | 87.95,38.1 v94.3,38.1 | D2G.A 86.36,39.69 87.95,38.1 | D3G.A 57.15,39.69 58.74,38.1
N$13  (via drill 0.6)
  Top 0.254: JP1.2 45.09,5.4 44.45,6.03 35.56,6.03 33.66,4.13 31.75,4.13 v30.8,5.08 | v26.67,15.56 26.67,18.37 U$5.31
  Bottom 0.254: v26.67,15.56 30.16,12.06 30.16,6.35 30.8,5.71 v30.8,5.08
N$14
  Top 0.254: U$1.13 92.16,55.8 92.79,55.8 93.03,55.56 93.03,54.93 93.03,52.7 93.03,52.39 92.71,52.07 R1.1
N$15  (via drill 0.6)
  Top 0.254: JP1.3 47.62,5.4 46.35,6.67 35.24,6.67 33.66,5.08 v32.7,5.08 | U$5.30 27.43,16.64 27.43,16.39 v28.26,15.56
  Bottom 0.254: v28.26,15.56 30.8,13.02 30.8,6.67 31.75,5.71 32.07,5.71 v32.7,5.08
N$16
  Top 0.254: JP1.1 C_DTR.2
N$18  (via drill 0.6)
  Top 0.254: U$5.13 29.03,7.76 v27.3,5.71
  Top 0.406: U$4.A 7.22,36.43 v7.3,36.51 | v7.3,27.94 7.3,27.3 10.16,24.45 v10.16,19.37
  Bottom 0.406: v7.3,36.51 v7.3,27.94 | v27.3,5.71 25.08,5.71 24.13,6.99 11.11,6.99 7.3,10.79 7.3,16.51 v10.16,19.37
N$19  (via drill 0.6)
  Top 0.254: U$5.14 29.83,7.61 28.57,6.35 v28.57,5.08
  Top 0.406: U$4.B v6.35,31.43 | v6.35,26.99 9.21,24.13 9.21,20 v8.57,19.37
  Bottom 0.406: v6.35,31.43 v6.35,26.99 | v8.57,19.37 6.35,17.14 6.03,16.83 6.03,10.48 10.48,6.03 23.5,6.03 24.45,4.76 28.26,4.76 v28.57,5.08
N$34
  Top 0.254: U$5.7 17.61,11.91 16.83,12.7 16.83,14.92 16.19,15.56 14.1,15.56 Q1.2
  Top 0.406: Q1.2 11.3,15.43 10.79,14.61 C_CRY.2
N$35
  Top 0.254: U$5.8 17.46,11.11 16.83,10.48 14.1,10.48 Q1.1
  Top 0.406: Q1.1 11.3,10.6 10.79,11.43 C_CRYS.2
PWRIN
  Top 1.27: D1.A 88.56,13.31 J1.PWR
RESET  (via drill 0.6)
  Top 0.254: C_DTR.1 31.11,3.49 29.53,5.08 29.53,5.71 30.48,6.67 34.29,6.67 34.92,7.3 39.37,7.3 ICSP.5 | U$5.29 28.23,16.86 28.57,16.51 28.89,16.51 v29.84,15.56
  Top 0.406: R3.1 40.64,18.41 39.05,16.83 39.05,15.56 38.1,14.61 v36.51,14.61
  Top 1.27: S1.3 S1.4
  Bottom 0.254: v29.84,15.56 31.75,13.65 | 31.75,13.65 31.75,7.94 32.07,7.62 39.69,7.62 ICSP.5 | 31.75,13.65 35.56,13.65 v36.51,14.61
  Bottom 0.406: S1.4 37.82,15.91 v36.51,14.61
SCK  (via drill 0.6)
  Top 0.254: U$5.17 v36.51,11.11
  Bottom 0.406: v36.51,11.11 40.64,11.11 ICSP.3
SCL  (via drill 0.6)
  Top 0.254: U$1.14 93.41,56.45 93.98,55.88 v93.98,54.61 | U$2.6 47.61,61.26 46.67,60.33 46.67,56.2 v45.72,55.24 | U$5.28 29.03,47.76 30.16,48.9
  Top 0.406: R_SCL_PU.2 v36.2,56.83 36.2,51.75 35.24,50.8 32.07,50.8 30.16,48.9 29.84,48.58
  Bottom 0.406: v93.98,54.61 93.66,54.29 77.47,54.29 76.52,54.29 v73.98,54.29 73.34,54.29 72.39,53.66 48.58,53.66 46.99,55.24 v45.72,55.24 36.83,55.24 36.2,55.88 v36.2,56.83
SDA  (via drill 0.6)
  Top 0.254: U$1.1 78.5,62.95 75.56,60.01 75.56,56.52 74.93,55.88 v73.98,55.88 | U$2.5 47.31,61.91 46.04,60.64 46.04,58.42 45.72,58.1 v44.45,56.83 | U$5.27 29.83,47.29 31.11,48.58
  Top 0.406: R_SDA_PU.2 v40.32,56.83 40.32,51.75 38.42,49.85 32.38,49.85 31.11,48.58 30.8,48.26
  Bottom 0.406: v73.98,55.88 72.07,54.61 70.8,54.61 48.9,54.61 46.67,56.83 v44.45,56.83 v40.32,56.83
V+
  Top 0.254: U$2.3 56.5,61.26 56.83,61.59
  Top 0.406: 56.83,61.59 70.8,61.59 72.07,60.33 U$3.V+
V_IN(3)
  Top 1.27: D1.C 83.82,16.49 C_REG_IN.+ 83.36,12.38 82.23,12.38 81.6,13.02 79.53,15.08 79.22,15.4 U$6.3
VCC  (via drill 0.6)
  Top 0.254: U$1.19 87,59.7 | C_LED_DRV.2 86.36,52.12 89.58,52.12 R1.2 | U$2.8 48.22,59.96 47.94,59.69 47.94,57.47 48.26,57.15 51.33,57.15 C4.2 | 24.16,14.29 U$5.4 24.11,14.29 21.75,14.29 21.75,15.08 21.27,15.56 20.05,15.56 C_BP1.2 19.95,15.56 18.1,15.56 17.46,14.92 17.46,13.34 18.09,12.71 U$5.6 24.75,12.71 24.77,12.7 25.08,12.7 26.04,12.7 26.67,13.34 30.16,13.34 31.43,12.06 31.59,11.91 U$5.18
  Top 0.406: 87,59.7 86.36,59.05 86.36,52.12 | C_LED_DRV.2 C_LED_DRV1.2 86.62,48.9 86.68,48.9 | 51.12,50.8 51.12,56.62 C4.2 51.33,57.15 | R_INT0_PU.1 R_SCL_PU.1 R_SDA_PU.1 42.01,60.54 42.55,60.01 42.55,52.39 43.5,51.44 50.16,51.44 51.12,50.48 | 31.65,60.64 22.54,60.64 18.41,60.64 | 18.41,60.64 JP2.1 | 18.41,60.64 18.1,60.33 R2.2 | C_BP1.2 v20,18.41 20,20.85 R4.2 | 46.25,18.31 46.35,18.41 R3.2 | 72.22,12.7 U$6.4
  Top 1.27: v91.76,18.41 91.76,43.81 86.68,48.9 | 51.12,50.8 51.12,50.48 51.12,46.04 v51.12,18.41 46.35,18.41 46.04,18.41 43.5,15.88 ICSP.2 | 31.65,60.64 R_INT0_PU.1 | 65.72,12.7 C_REG_OUT.+ | C7.2 60.33,12.38 60.64,12.7 | 65.72,12.7 60.64,12.7 | 60.64,12.7 60.33,12.7 v60.33,18.41 | v60.33,18.41 62.87,18.41 v64.77,18.41 v60.33,18.41 | 65.72,12.7 U$6.4 72.22,12.7 U$6.2
  Bottom 1.27: v91.76,18.41 v64.77,18.41 v60.33,18.41 56.2,18.41 v51.12,18.41 | v20,18.41 24.13,18.41 36.83,18.41 v51.12,18.41 | JP3.1 33.02,3.49 33.34,3.49 35.88,6.03 36.2,6.35 49.53,6.35 50.01,6.83 | 50.01,6.83 51.12,7.94 v51.12,18.41 | JP1.4 50.16,6.67 50.01,6.83

### Text on the board
_tsilk: Ver1.0 11.26.12